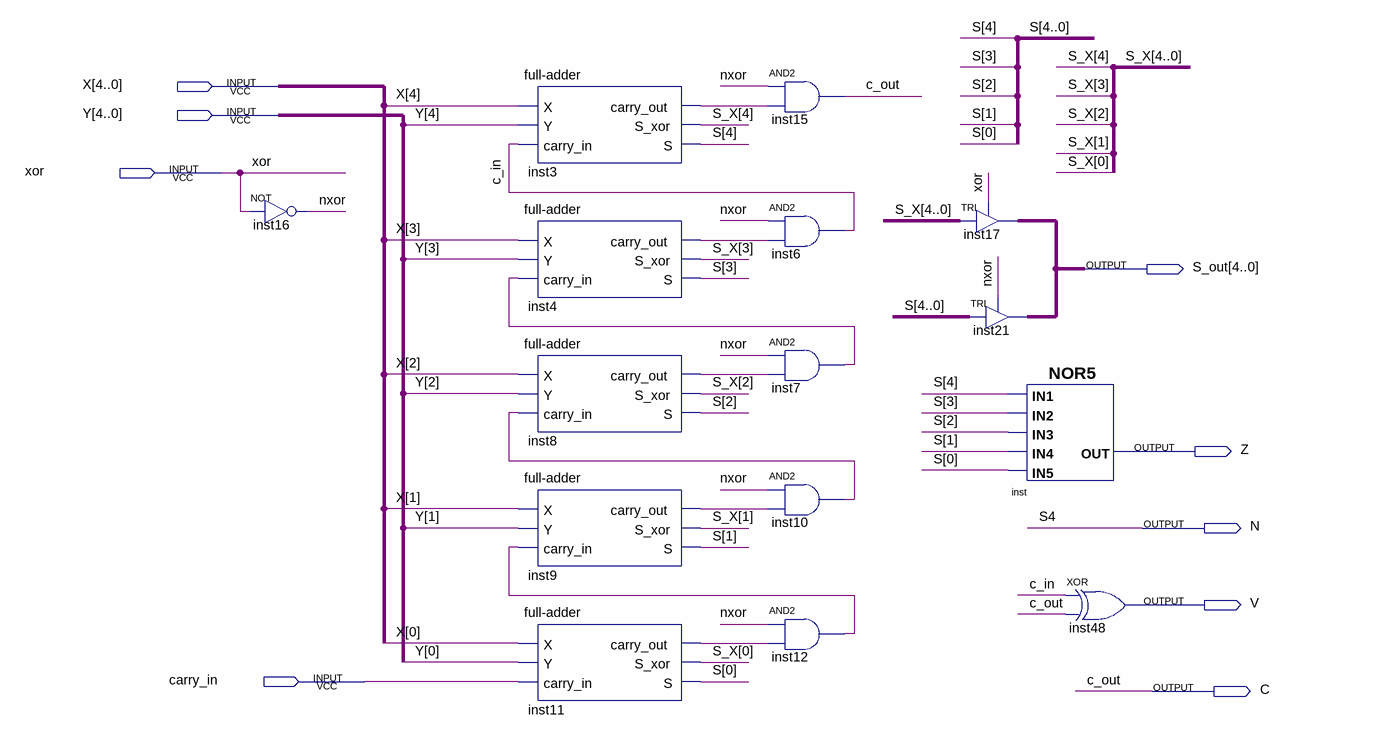
[diagram p0: schematic sheet]
// Quartus schematic Somador.bdf as structural Verilog: 15 symbols, 9 pins
module Somador (
  input  [4:0] X,
  input  [4:0] Y,
  input  \xor ,
  input  carry_in,
  output [4:0] S_out,
  output Z,
  output N,
  output V,
  output C
);

  wire c_in, inst3_carry_out, inst4_carry_out, inst7_out, inst8_carry_out, inst9_carry_out, inst10_out,
       inst11_carry_out, inst12_out, nxor;
  wire [3:0] S;
  wire [4:0] S_X;

  not inst16 (nxor, \xor );
  \full-adder  inst3 (.X(X[4]), .Y(Y[4]), .carry_in(c_in), .carry_out(inst3_carry_out), .S_xor(S_X[4]), .S(N));
  \full-adder  inst4 (.X(X[3]), .Y(Y[3]), .carry_in(inst7_out), .carry_out(inst4_carry_out), .S_xor(S_X[3]), .S(S[3]));
  \full-adder  inst8 (.X(X[2]), .Y(Y[2]), .carry_in(inst10_out), .carry_out(inst8_carry_out), .S_xor(S_X[2]), .S(S[2]));
  \full-adder  inst9 (.X(X[1]), .Y(Y[1]), .carry_in(inst12_out), .carry_out(inst9_carry_out), .S_xor(S_X[1]), .S(S[1]));
  \full-adder  inst11 (.X(X[0]), .Y(Y[0]), .carry_in(carry_in), .carry_out(inst11_carry_out), .S_xor(S_X[0]), .S(S[0]));
  and inst15 (C, nxor, inst3_carry_out);
  and inst6 (c_in, nxor, inst4_carry_out);
  and inst7 (inst7_out, nxor, inst8_carry_out);
  and inst10 (inst10_out, nxor, inst9_carry_out);
  and inst12 (inst12_out, nxor, inst11_carry_out);
  TRI inst17[4:0] (.IN(S_X), .OE(\xor ), .OUT(S_out));
  TRI inst21[4:0] (.IN({N, S}), .OE(nxor), .OUT(S_out));
  nor inst (Z, N, S[3], S[2], S[1], S[0]);
  xor inst48 (V, c_in, C);

  // Other names for the same wires on the sheet: c_out = C; S[4] = N; S4 = N
endmodule
